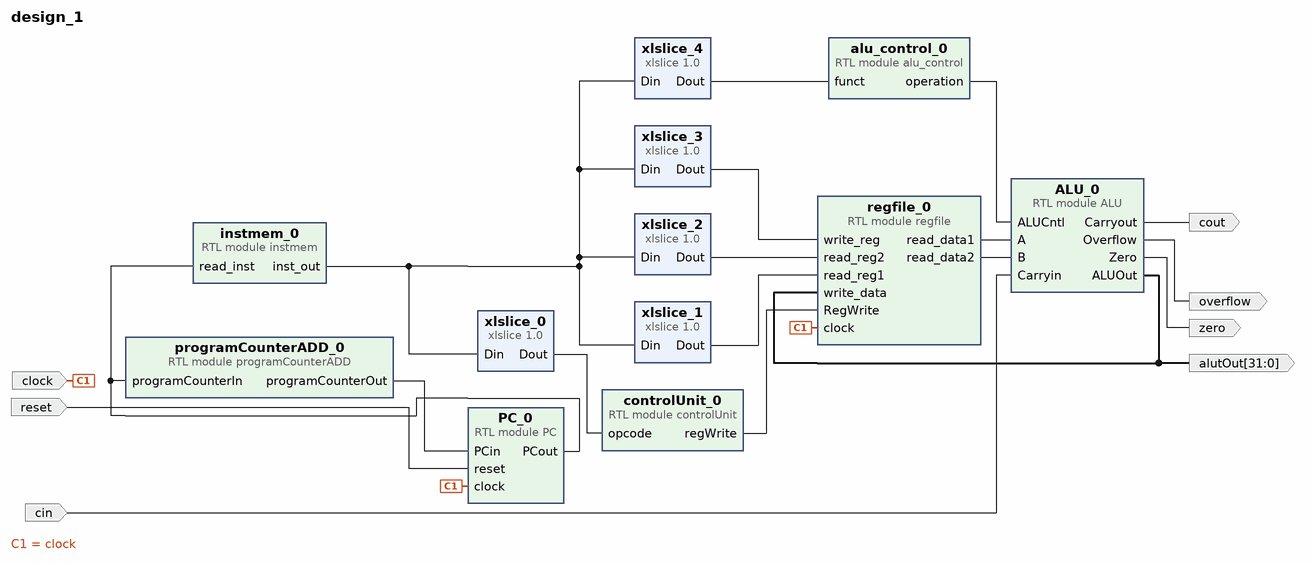
[diagram p0: block diagram of the top level]
# Vivado block design design_1, xc7k70tfbv676-1, Vivado 2019.2.1
create_bd_design design_1

create_bd_port -dir I -type clk clock
set_property -dict {CONFIG.FREQ_HZ 100000000} [get_bd_ports clock]
create_bd_port -dir I -type rst reset
set_property -dict {CONFIG.POLARITY ACTIVE_HIGH} [get_bd_ports reset]
create_bd_port -dir I -type data cin
create_bd_port -dir O -type data zero
create_bd_port -dir O -type data cout
create_bd_port -dir O -type data overflow
create_bd_port -dir O -from 31 -to 0 -type data alutOut

create_bd_cell -type module -reference instmem instmem_0
create_bd_cell -type module -reference programCounterADD programCounterADD_0
create_bd_cell -type ip -vlnv xilinx.com:ip:xlslice:1.0 xlslice_0
set_property -dict {CONFIG.DIN_FROM 31 CONFIG.DIN_TO 26 CONFIG.DOUT_WIDTH 6} [get_bd_cells xlslice_0]
create_bd_cell -type ip -vlnv xilinx.com:ip:xlslice:1.0 xlslice_1
set_property -dict {CONFIG.DIN_FROM 25 CONFIG.DIN_TO 21 CONFIG.DOUT_WIDTH 5} [get_bd_cells xlslice_1]
create_bd_cell -type ip -vlnv xilinx.com:ip:xlslice:1.0 xlslice_2
set_property -dict {CONFIG.DIN_FROM 20 CONFIG.DIN_TO 16 CONFIG.DOUT_WIDTH 5} [get_bd_cells xlslice_2]
create_bd_cell -type ip -vlnv xilinx.com:ip:xlslice:1.0 xlslice_3
set_property -dict {CONFIG.DIN_FROM 15 CONFIG.DIN_TO 11 CONFIG.DOUT_WIDTH 5} [get_bd_cells xlslice_3]
create_bd_cell -type ip -vlnv xilinx.com:ip:xlslice:1.0 xlslice_4
set_property -dict {CONFIG.DIN_FROM 5 CONFIG.DIN_TO 0 CONFIG.DOUT_WIDTH 6} [get_bd_cells xlslice_4]
create_bd_cell -type module -reference regfile regfile_0
create_bd_cell -type module -reference alu_control alu_control_0
create_bd_cell -type module -reference ALU ALU_0
create_bd_cell -type module -reference PC PC_0
create_bd_cell -type module -reference controlUnit controlUnit_0

# ---- connections ----

connect_bd_net -net programCounter_0_Dout [get_bd_pins PC_0/PCout] \
  [get_bd_pins instmem_0/read_inst] [get_bd_pins programCounterADD_0/programCounterIn]
connect_bd_net [get_bd_pins instmem_0/inst_out] \
  [get_bd_pins xlslice_0/Din] [get_bd_pins xlslice_1/Din] [get_bd_pins xlslice_2/Din] [get_bd_pins xlslice_3/Din] \
  [get_bd_pins xlslice_4/Din]
connect_bd_net [get_bd_pins xlslice_0/Dout] [get_bd_pins controlUnit_0/opcode]
connect_bd_net [get_bd_pins controlUnit_0/regWrite] [get_bd_pins regfile_0/RegWrite]
connect_bd_net [get_bd_pins xlslice_1/Dout] [get_bd_pins regfile_0/read_reg1]
connect_bd_net [get_bd_pins xlslice_2/Dout] [get_bd_pins regfile_0/read_reg2]
connect_bd_net [get_bd_pins xlslice_3/Dout] [get_bd_pins regfile_0/write_reg]
connect_bd_net [get_bd_pins xlslice_4/Dout] [get_bd_pins alu_control_0/funct]
connect_bd_net [get_bd_pins alu_control_0/operation] [get_bd_pins ALU_0/ALUCntl]
connect_bd_net [get_bd_pins regfile_0/read_data1] [get_bd_pins ALU_0/A]
connect_bd_net [get_bd_pins regfile_0/read_data2] [get_bd_pins ALU_0/B]
connect_bd_net [get_bd_ports clock] [get_bd_pins regfile_0/clock] [get_bd_pins PC_0/clock]
connect_bd_net [get_bd_ports cin] [get_bd_pins ALU_0/Carryin]
connect_bd_net [get_bd_pins ALU_0/Zero] [get_bd_ports zero]
connect_bd_net [get_bd_pins ALU_0/Carryout] [get_bd_ports cout]
connect_bd_net [get_bd_pins ALU_0/Overflow] [get_bd_ports overflow]
connect_bd_net [get_bd_pins ALU_0/ALUOut] [get_bd_ports alutOut] [get_bd_pins regfile_0/write_data]
connect_bd_net [get_bd_ports reset] [get_bd_pins PC_0/reset]
connect_bd_net [get_bd_pins programCounterADD_0/programCounterOut] [get_bd_pins PC_0/PCin]

validate_bd_design
save_bd_design
